# Altium schematic sheet unifying_sht2.SchDoc
size 209 x 297 mm; CheckedBy: Саруханов В.А.; Author: Кузнецов Д.П.; DrawnBy: Кузнецов Д.П.; Revision: 1; SheetNumber: 2; SheetTotal: 2; PageSetup: Record=PageOptions|CenterHorizontal=False|CenterVertical=False|PrintScale=0.95|XCorrection=0.00|YCorrection=0.00|PrintKind=1|BorderSize=5000000|LeftOffset=0|BottomOffset=0|Orientation=1|PaperLength=1000|PaperWidth=1000|Scale=100|PaperSource=15|PrintQuality=600|MediaType=1|DitherType=10|PaperKind=A4|PrintScaleMode=1; Scale: {Масш.}; Title1str: Объединительная; Title2str: плата; ProcessInspection: {Т.контр.}; Letter2Column: Т
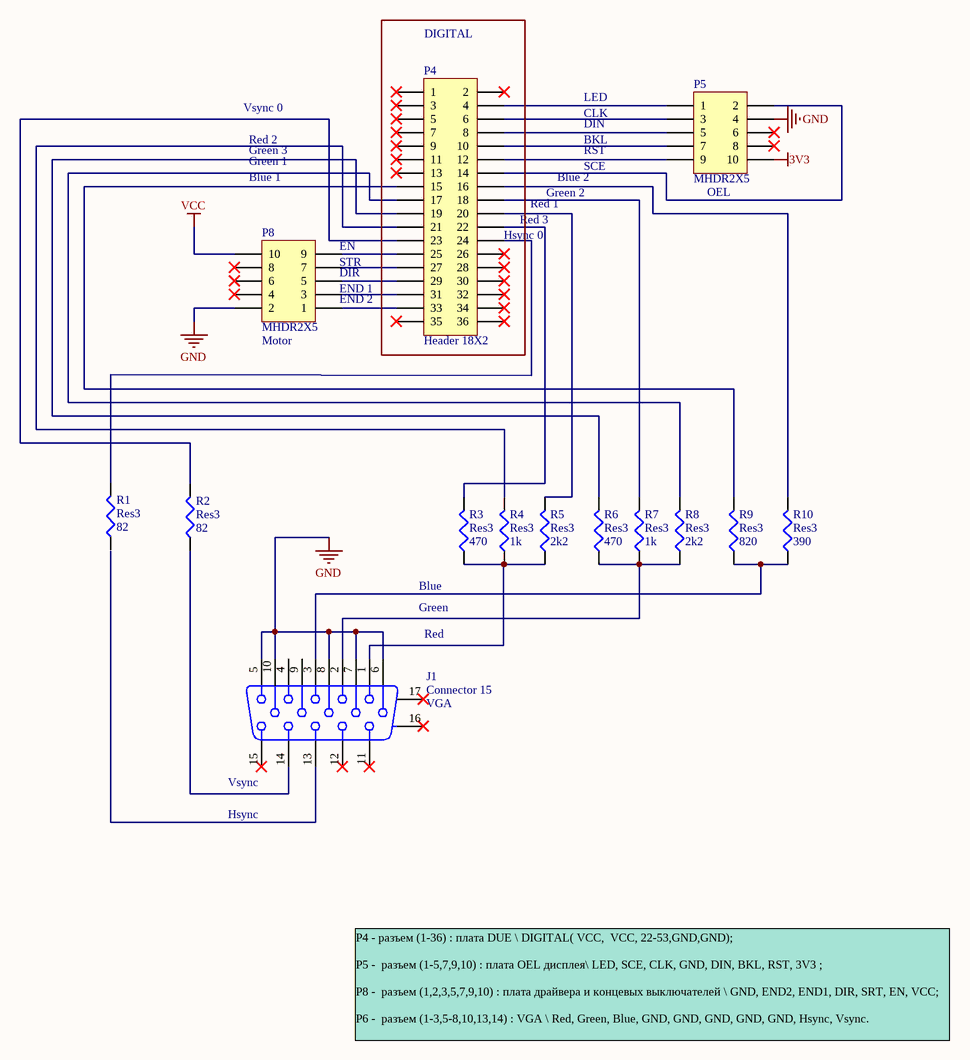
[diagram p0: unifying_sht2.SchDoc]

## Parts
J1  Connector 15  [050DSUB0.762-4H15]
P4  Header 18X2  [HDR2X18]
P5  MHDR2X5  [MHDR2X5]
P8  MHDR2X5  [MHDR2X5]
R1  Res3  value 82  [J1-0603]
R2  Res3  value 82  [J1-0603]
R3  Res3  value 470  [J1-0603]
R4  Res3  value 1k  [J1-0603]
R5  Res3  value 2k2  [J1-0603]
R6  Res3  value 470  [J1-0603]
R7  Res3  value 1k  [J1-0603]
R8  Res3  value 2k2  [J1-0603]
R9  Res3  value 820  [J1-0603]
R10  Res3  value 390  [J1-0603]

## Nets
3V3: P5.10
GND: J1.5 J1.6 J1.7 J1.8 J1.10 P5.4 P8.2
VCC: P8.10
NetJ1_1: J1.1 R3.1 R4.1 R5.1
NetJ1_2: J1.2 R6.1 R7.1 R8.1
NetJ1_3: J1.3 R9.1 R10.1
NetJ1_14: J1.14 R2.1
NetP4_4: P4.4 P5.1
NetP4_6: P4.6 P5.3
NetP4_8: P4.8 P5.5
NetP4_10: P4.10 P5.7
NetP4_12: P4.12 P5.9
NetP4_14: P4.14 P5.2
NetP4_15: P4.15 R9.2
NetP4_16: P4.16 R10.2
NetP4_17: P4.17 R8.2
NetP4_18: P4.18 R7.2
NetP4_19: P4.19 R6.2
NetP4_20: P4.20 R5.2
NetP4_21: P4.21 R4.2
NetP4_22: P4.22 R3.2
NetP4_23: P4.23 R2.2
NetP4_24: P4.24 R1.2
NetP4_25: P4.25 P8.9
NetP4_27: P4.27 P8.7
NetP4_29: P4.29 P8.5
NetP4_31: P4.31 P8.3
NetP4_33: P4.33 P8.1

Not connected (* = marked no-connect by the designer): J1 4 9 11* 12* 13 15* 16(MH1)* 17(MH2)*; P4 1* 2* 3* 5* 7* 9* 11* 13* 26* 28* 30* 32* 34* 35* 36*; P5 6* 8*; P8 4* 6* 8*; R1 1

## Notes on the sheet
- (near P4) DIGITAL
- Vsync 0
- Red 2
- LED
- CLK
- DIN
- BKL
- Blue 1
- Green 1
- Green 3
- (near P4) Red 1
- Green 2
- Blue 2
- RST
- SCE
- (near P8) EN
- (near P8) STR
- (near P8) DIR
- (near P4) Hsync 0
- (near P4) Red 3
- (near P8) END 1
- (near P8) END 2
- (near R3) Blue
- Green
- Red
- Hsync
- (near J1) Vsync
- Р4 - разъем (1-36) : плата DUE \ DIGITAL( VCC,  VCC, 22-53,GND,GND);
  Р5 -  разъем (1-5,7,9,10) : плата OEL дисплея\ LED, SCE, CLK, GND, DIN, BKL, RST, 3V3 ;
  Р8 -  разъем (1,2,3,5,7,9,10) : плата драйвера и концевых выключателей \ GND, END2, END1, DIR, SRT, EN, VCC;
  Р6 -  разъем (1-3,5-8,10,13,14) : VGA \ Red, Green, Blue, GND, GND, GND, GND, GND, Hsync, Vsync.
- Перв. примен.
- Справ. №
- Подп. и дата
- Инв. № дубл.
- Взам. инв. №
- Пров.
- Разраб.
- Изм.
- Лист
- № докум.
- Подп.
- Дата
- Лит.
- Листов
- Инв. № подл.
- Н.контр.
- Утв.
- (in symbol Connector 15) VGA
- (in symbol MHDR2X5) Motor; OEL

## Library data of the parts
J1 = Connector 15: Receptacle Assembly, 15-Pin, Sim Line Connector; PackageDocument: B; Positions: 15; Gender: Receptacle Header; Published: 15-Jun-2001; LatestRevisionDate: 17-Jul-2002; LatestRevisionNote: Re-released for DXP Platform.; DatasheetDocument: 24-Nov-1999; PackageReference: 788574; Publisher: Altium Limited; Orientation: Right Angle
P4 = Header 18X2: Header, 18-Pin, Dual row; LatestRevisionDate: 17-Jul-2002; LatestRevisionNote: Re-released for DXP Platform.; Publisher: Altium Limited
P5 P8 = MHDR2X5: Header, 5-Pin, Dual row; LatestRevisionDate: 17-Jul-2002; LatestRevisionNote: Re-released for DXP Platform.; Publisher: Altium Limited
R1-R10 = Res3: Resistor; Published: 8-Jun-2000; LatestRevisionDate: 29-May-2009; LatestRevisionNote: IPC-7351 Footprint Added.; PackageReference: J1-0603; Publisher: Altium Limited; PackageDescription: Chip Resistor